# EasyEDA schematic 220V 1500Watt Masttech.json
TITLE: Sheet_1; REV: 1.0; Date: 2022-08-23; Sheet: 1/1; Company: Your Company
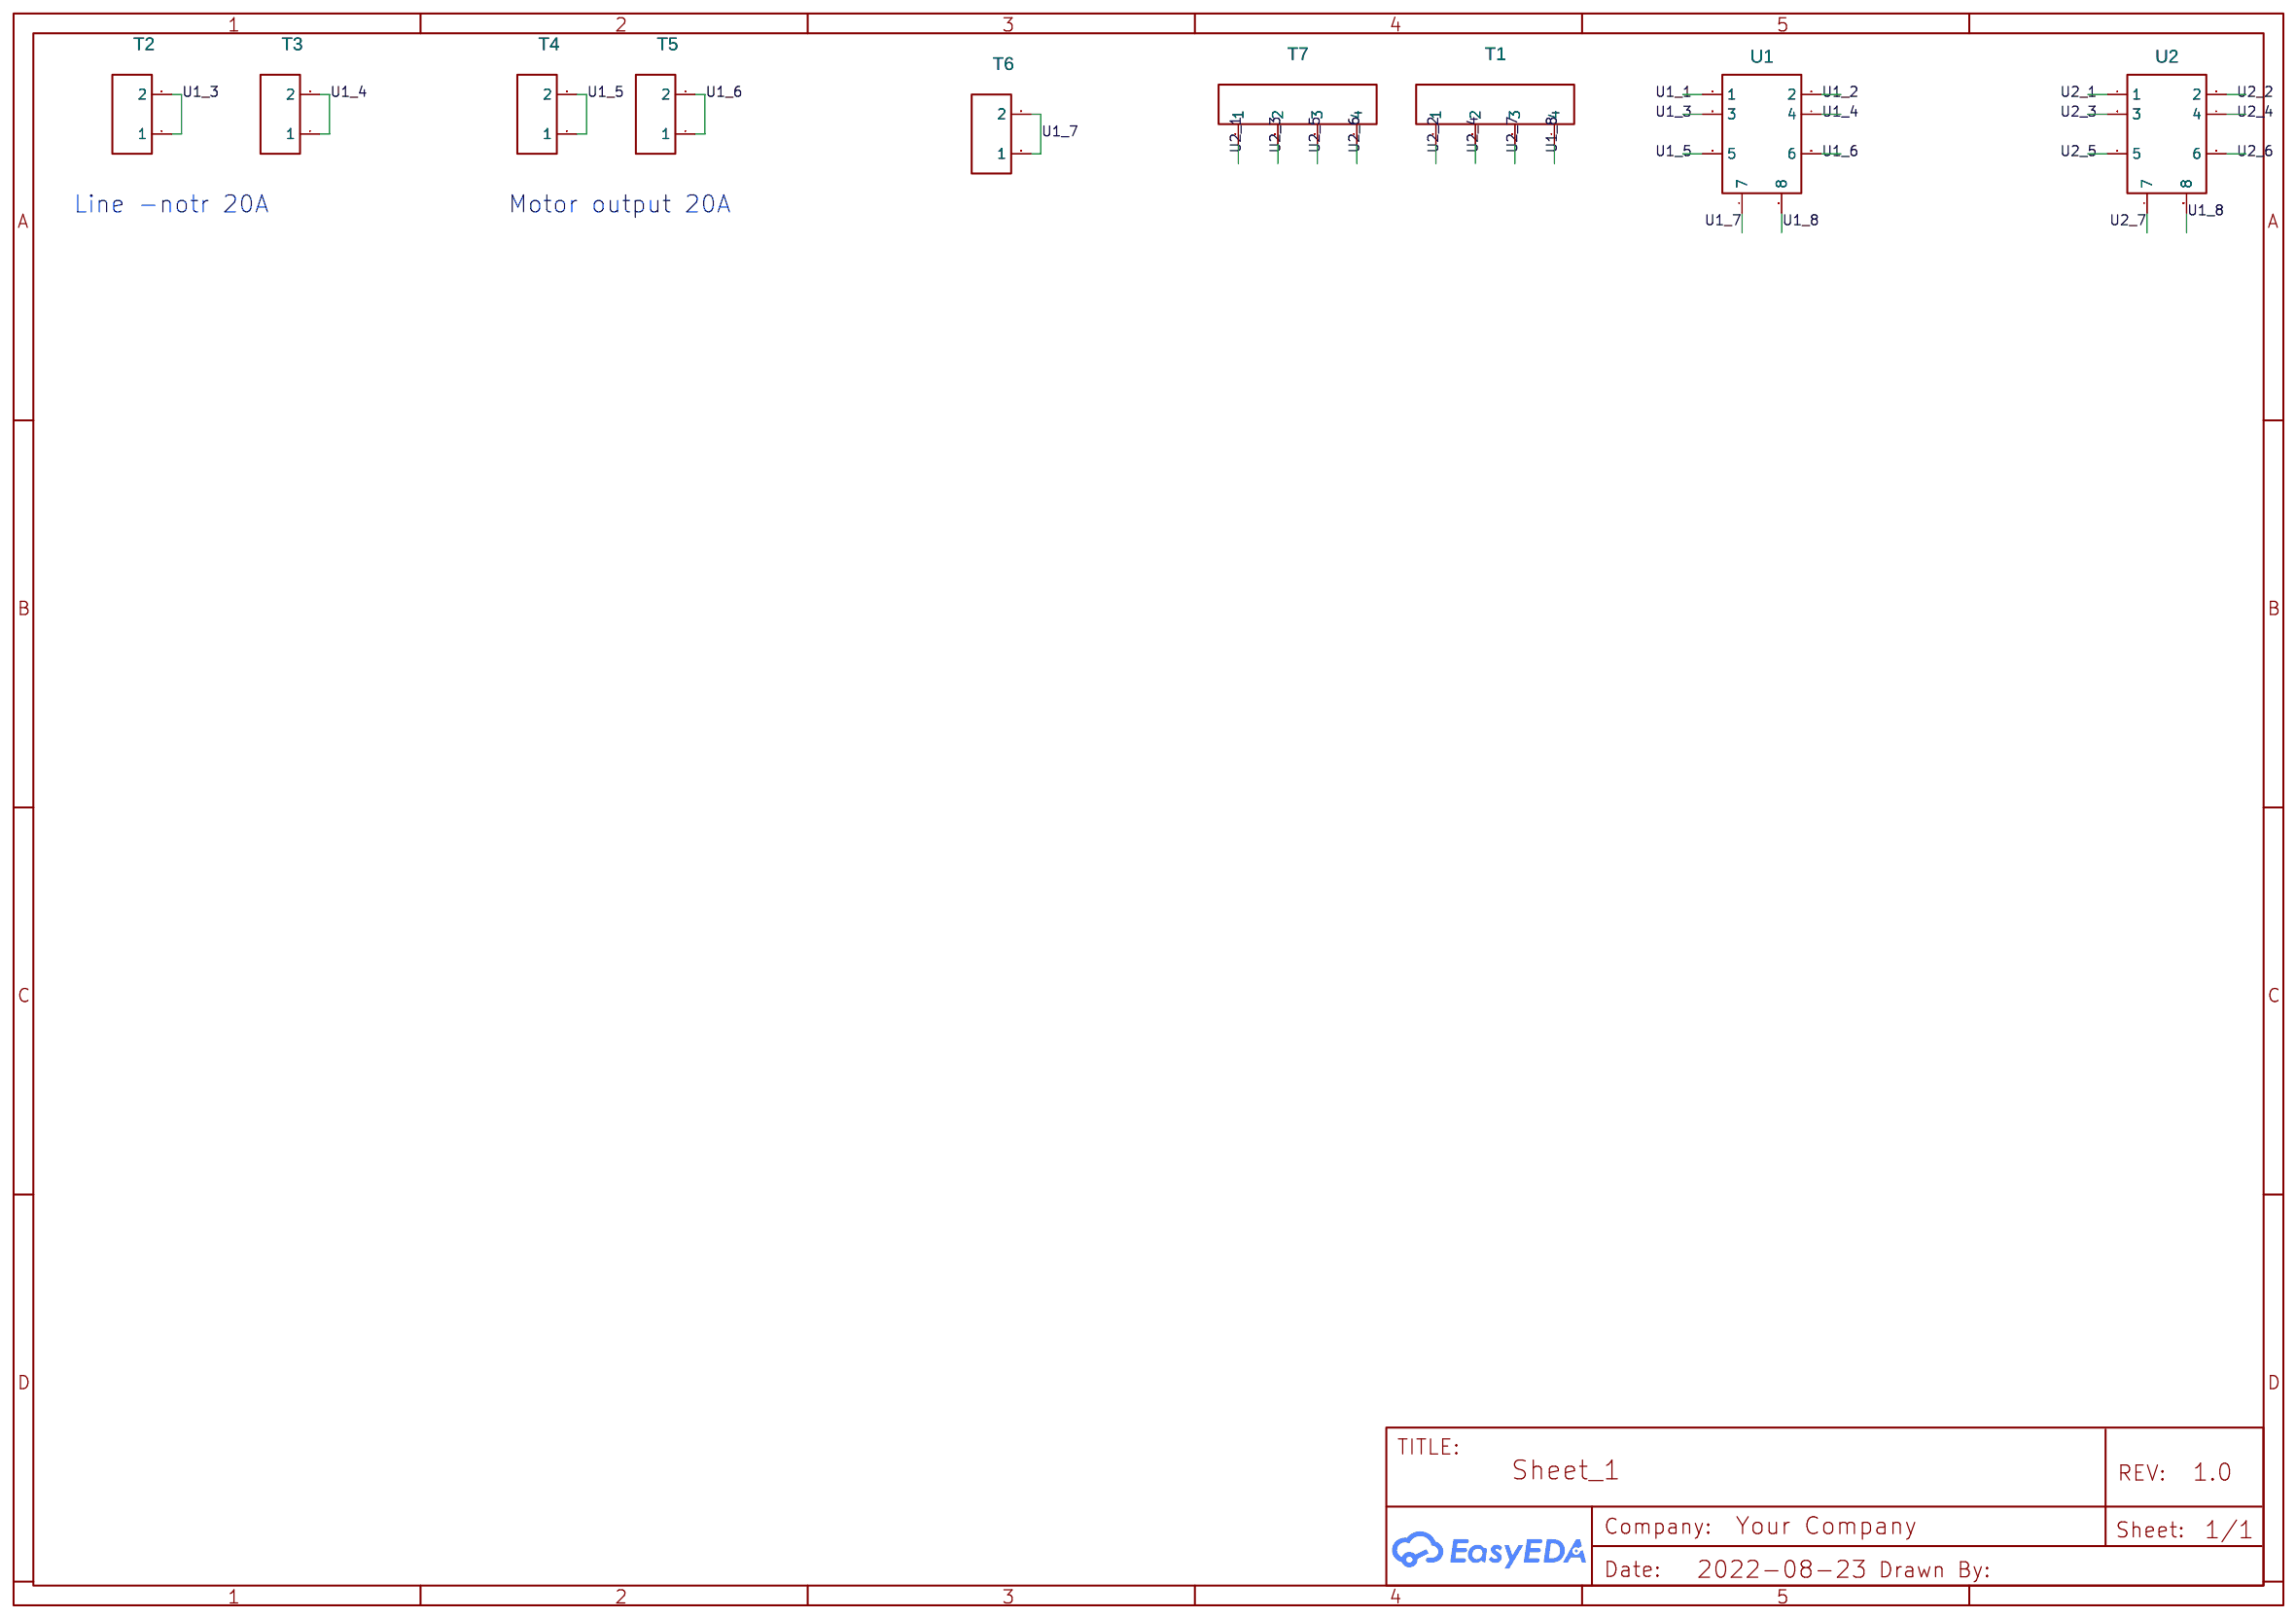
[diagram p0: schematic sheet]

## Parts
T1  1x4 6A Terminal  [KLAMENTS]
T2  1x2 30A Molex Terminal  [30A TERMINAL]
T3  1x2 30A Molex Terminal  [30A TERMINAL]
T4  1x2 30A Molex Terminal  [30A TERMINAL]
T5  1x2 30A Molex Terminal  [30A TERMINAL]
T6  1x2 30A Molex Terminal  [30A TERMINAL]
T7  1x4 6A Terminal  [KLAMENTS]
U1  relay_56.32  [RELAY 56.32.9]
U2  relay_56.32  [RELAY 56.32.9]

## Library data of the parts
T1 T7 = 1x4 6A Terminal: Contributor: hasankayan2000
T2-T6 = 1x2 30A Molex Terminal: Contributor: hasankayan2000
U1 U2 = relay_56.32: Contributor: hasankayan2000

## Nets
U1_1: U1.1
U1_2: U1.2
U1_3: T2.1 T2.2 U1.3
U1_4: T3.1 T3.2 U1.4
U1_5: T4.1 T4.2 U1.5
U1_6: T5.1 T5.2 U1.6
U1_7: T6.1 T6.2 U1.7
U1_8: T1.4 U1.8 U2.8
U2_1: T7.1 U2.1
U2_2: T1.1 U2.2
U2_3: T7.2 U2.3
U2_4: T1.2 U2.4
U2_5: T7.3 U2.5
U2_6: T7.4 U2.6
U2_7: T1.3 U2.7

## Notes on the sheet
- Line -notr 20A
- Motor output 20A
